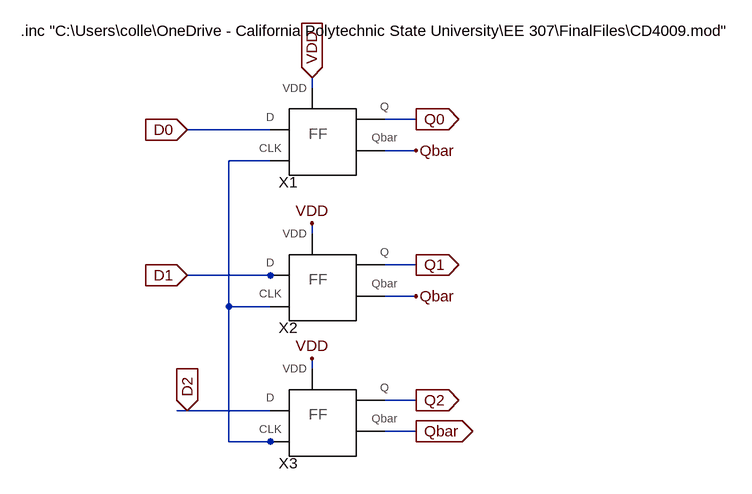
[diagram p0: schematic Reg_inc.asc]
Reg_inc.asc, the LTspice schematic file:
Version 4
SHEET 1 880 760
WIRE -80 160 -80 144
WIRE 80 208 32 208
WIRE -144 224 -272 224
WIRE 80 256 32 256
WIRE -144 272 -208 272
WIRE -80 384 -80 368
WIRE 80 432 32 432
WIRE -144 448 -272 448
WIRE -128 448 -144 448
WIRE 80 480 32 480
WIRE -208 496 -208 272
WIRE -144 496 -208 496
WIRE -80 592 -80 576
WIRE 80 640 32 640
WIRE -272 656 -288 656
WIRE -144 656 -272 656
WIRE 80 688 32 688
WIRE -208 704 -208 496
WIRE -144 704 -208 704
WIRE -128 704 -144 704
FLAG -80 144 VDD
IOPIN -80 144 In
FLAG -80 368 VDD
FLAG -80 576 VDD
FLAG -272 224 D0
IOPIN -272 224 In
FLAG -272 448 D1
IOPIN -272 448 In
FLAG -272 656 D2
IOPIN -272 656 In
FLAG 80 640 Q2
IOPIN 80 640 Out
FLAG 80 432 Q1
IOPIN 80 432 Out
FLAG 80 208 Q0
IOPIN 80 208 Out
FLAG 80 256 Qbar
FLAG 80 480 Qbar
FLAG 80 688 Qbar
IOPIN 80 688 Out
SYMBOL FlipFlop -80 208 R0
SYMATTR InstName X1
SYMBOL FlipFlop -80 432 R0
SYMATTR InstName X2
SYMBOL FlipFlop -80 640 R0
SYMATTR InstName X3
TEXT -528 72 Left 2 !.inc "C:\\Users\\colle\\OneDrive - California Polytechnic State University\\EE 307\\FinalFiles\\CD4009.mod"

The netlist it stands for:
* Reg_inc.asc
XX1 D0 N001 VDD Q0 Qbar FlipFlop  ; pins D CLK VDD Q Qbar
XX2 D1 N001 VDD Q1 Qbar FlipFlop  ; pins D CLK VDD Q Qbar
XX3 D2 N001 VDD Q2 Qbar FlipFlop  ; pins D CLK VDD Q Qbar
.inc "C:\Users\colle\OneDrive - California Polytechnic State University\EE 307\FinalFiles\CD4009.mod"
.backanno
.end